# EAGLE schematic circle (EAGLE 9.6.2)
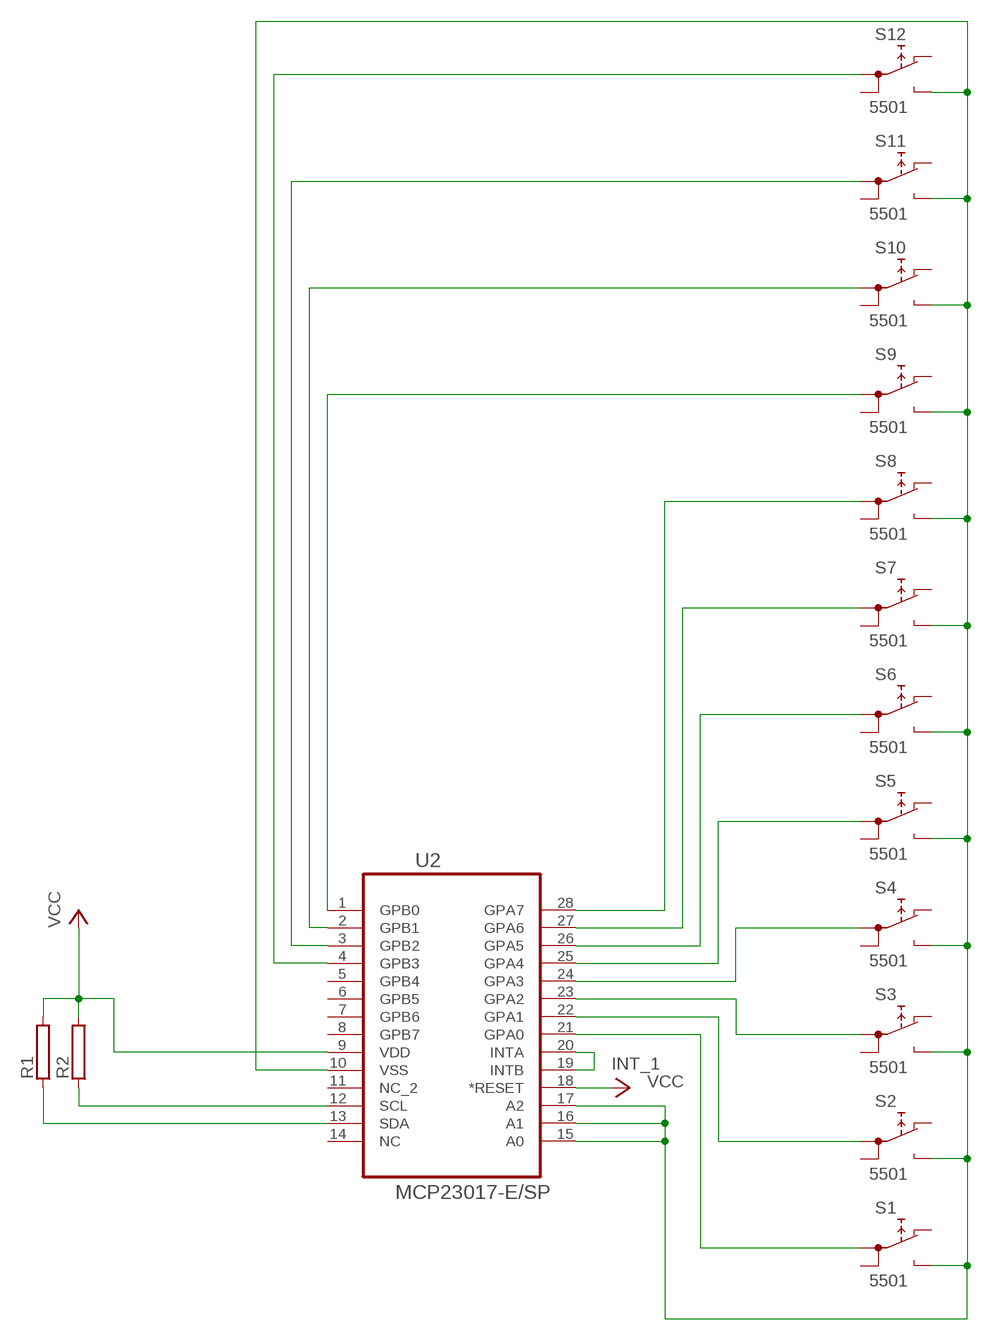
[diagram p0: schematic, sheet 1]

## Parts
R1  RAC01  [AC01]
R2  RAC01  [AC01]
S1  5501  [5501]
S2  5501  [5501]
S3  5501  [5501]
S4  5501  [5501]
S5  5501  [5501]
S6  5501  [5501]
S7  5501  [5501]
S8  5501  [5501]
S9  5501  [5501]
S10  5501  [5501]
S11  5501  [5501]
S12  5501  [5501]
U2  MCP23017-E/SP  [DIP254P762X406-28P]

## Nets
INT_1: U2.19(INTB) U2.20(INTA)
N$1: S1.1A U2.21(GPA0)
N$2: S2.1A U2.22(GPA1)
N$3: S3.1A U2.23(GPA2)
N$4: S4.1A U2.24(GPA3)
N$5: S5.1A U2.25(GPA4)
N$6: S6.1A U2.26(GPA5)
N$7: S7.1A U2.27(GPA6)
N$8: S8.1A U2.28(GPA7)
N$9: S9.1A U2.1(GPB0)
N$10: S10.1A U2.2(GPB1)
N$11: S11.1A U2.3(GPB2)
N$12: S12.1A U2.4(GPB3)
N$13: R1.1 U2.13(SDA)
N$14: R2.1 U2.12(SCL)
N$25: S1.NO S2.NO S3.NO S4.NO S5.NO S6.NO S7.NO S8.NO S9.NO S10.NO S11.NO S12.NO U2.10(VSS) U2.15(A0) U2.16(A1) U2.17(A2)
VCC: R1.2 R2.2 U2.9(VDD) U2.18(*RESET)
Unconnected: S1.1B S1.NC S2.1B S2.NC S3.1B S3.NC S4.1B S4.NC S5.1B S5.NC S6.1B S6.NC S7.1B S7.NC S8.1B S8.NC S9.1B S9.NC S10.1B S10.NC S11.1B S11.NC S12.1B S12.NC U2.5(GPB4) U2.6(GPB5) U2.7(GPB6) U2.8(GPB7) U2.11(NC_2) U2.14(NC)

## Library data of the parts
R1 R2 = resistor-power:R: Power Resitor; OC_FARNELL: unknown; OC_NEWARK: unknown
S1-S12 = switch:55?: PUSHBUTTON SERIES 5500 SWITCHES Source: www.e-switch.com .. 5500.pdf
U2 = MCP23017:MCP23017-E/SP: IC, 16-Bit I/O Expander with Serial Interface, DIP-28; MPN: MCP23017-E/SP; OC_FARNELL: 1332088; OC_NEWARK: 31K2959; PACKAGE: DIP-28; SUPPLIER: Microchip